# Altium schematic sheet radio.SchDoc
size Letter; CompanyName: Signal Laboratories, Inc.; Address1: 3479 Edison Way; Address2: Menlo Park CA 94025; Address3: +1 (877) 778-8435; Address4: siglabs.com; Revision: 1; SheetNumber: 1; SheetTotal: 1
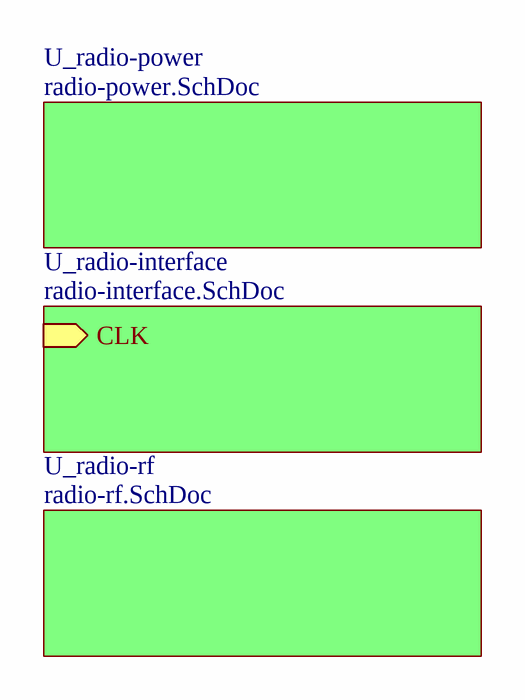
[diagram p0: radio.SchDoc]

## Sub-sheets
U_radio-interface = radio-interface.SchDoc: CLK (in)
U_radio-power = radio-power.SchDoc: no entries
U_radio-rf = radio-rf.SchDoc: no entries

## Notes on the sheet
- Title
- Engineer
- Revision
- Drawn By
- Checked By
- Date
- Sheet
- of